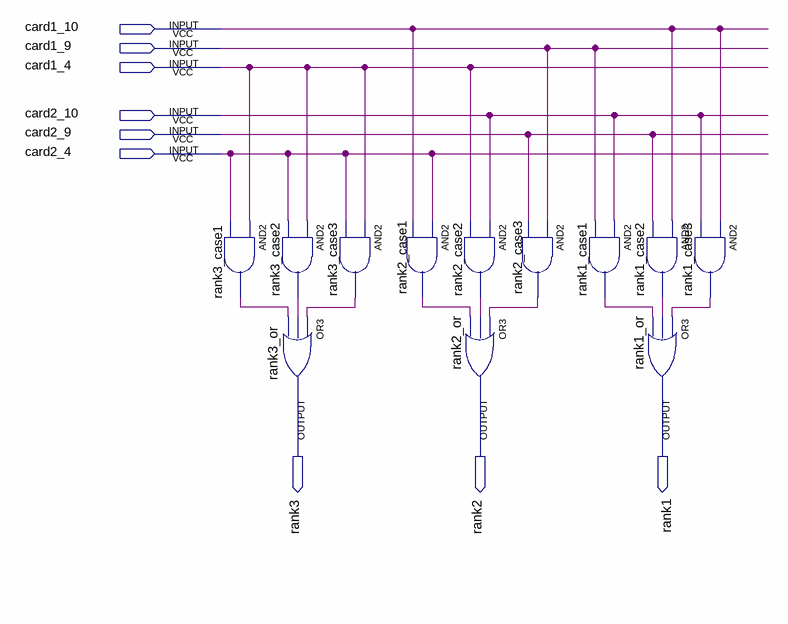
[diagram p0: schematic sheet]
// Quartus schematic rankdiscriber.bdf as structural Verilog: 12 symbols, 9 pins
module rankdiscriber (
  input  card1_10,
  input  card1_9,
  input  card1_4,
  input  card2_10,
  input  card2_9,
  input  card2_4,
  output rank3,
  output rank2,
  output rank1
);

  wire rank1_case1_out, rank1_case2_out, rank1_case3_out, rank2_case1_out, rank2_case2_out, rank2_case3_out,
       rank3_case1_out, rank3_case2_out, rank3_case3_out;

  and rank3_case1 (rank3_case1_out, card1_4, card2_4);
  and rank3_case2 (rank3_case2_out, card1_4, card2_4);
  or rank3_or (rank3, rank3_case3_out, rank3_case2_out, rank3_case1_out);
  and rank3_case3 (rank3_case3_out, card1_4, card2_4);
  and rank2_case1 (rank2_case1_out, card2_4, card1_10);
  and rank2_case2 (rank2_case2_out, card2_10, card1_4);
  or rank2_or (rank2, rank2_case3_out, rank2_case2_out, rank2_case1_out);
  and rank2_case3 (rank2_case3_out, card1_9, card2_9);
  and rank1_case1 (rank1_case1_out, card2_10, card1_9);
  and rank1_case2 (rank1_case2_out, card1_10, card2_9);
  and rank1_case3 (rank1_case3_out, card1_10, card2_10);
  or rank1_or (rank1, rank1_case3_out, rank1_case2_out, rank1_case1_out);
endmodule
